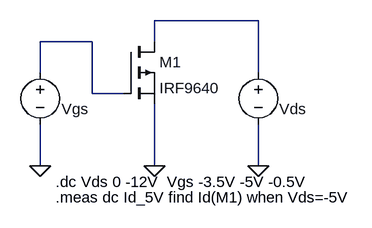
[diagram p0: schematic output-1-1-2.asc]
output-1-1-2.asc, the LTspice schematic file:
Version 4
SHEET 1 1292 680
WIRE -560 -96 -720 -96
WIRE -816 -64 -896 -64
WIRE -720 -64 -720 -96
WIRE -896 -16 -896 -64
WIRE -560 -16 -560 -96
WIRE -816 16 -816 -64
WIRE -768 16 -816 16
WIRE -896 128 -896 64
WIRE -720 128 -720 32
WIRE -560 128 -560 64
FLAG -560 128 0
FLAG -896 128 0
FLAG -720 128 0
SYMBOL voltage -560 -32 R0
WINDOW 123 0 0 Left 2
WINDOW 39 37 60 Left 2
WINDOW 0 32 72 Left 2
WINDOW 3 37 60 Left 2
SYMATTR InstName Vds
SYMATTR Value ""
SYMBOL voltage -896 -32 R0
WINDOW 123 0 0 Left 2
WINDOW 39 40 53 Left 2
WINDOW 3 40 69 Left 2
WINDOW 0 33 72 Left 2
SYMATTR Value ""
SYMATTR InstName Vgs
SYMBOL pmos -768 -64 R0
SYMATTR InstName M1
SYMATTR Value IRF9640
TEXT -872 152 Left 2 !.dc Vds 0 -12V  Vgs -3.5V -5V -0.5V
TEXT -872 176 Left 2 !.meas dc Id_5V find Id(M1) when Vds=-5V

The netlist it stands for:
* output-1-1-2.asc
Vds N001 0
Vgs N002 0
M1 N001 N002 0 0 IRF9640
.model NMOS NMOS
.model PMOS PMOS
.lib standard.mos
.dc Vds 0 -12V  Vgs -3.5V -5V -0.5V
.meas dc Id_5V find Id(M1) when Vds=-5V
.backanno
.end